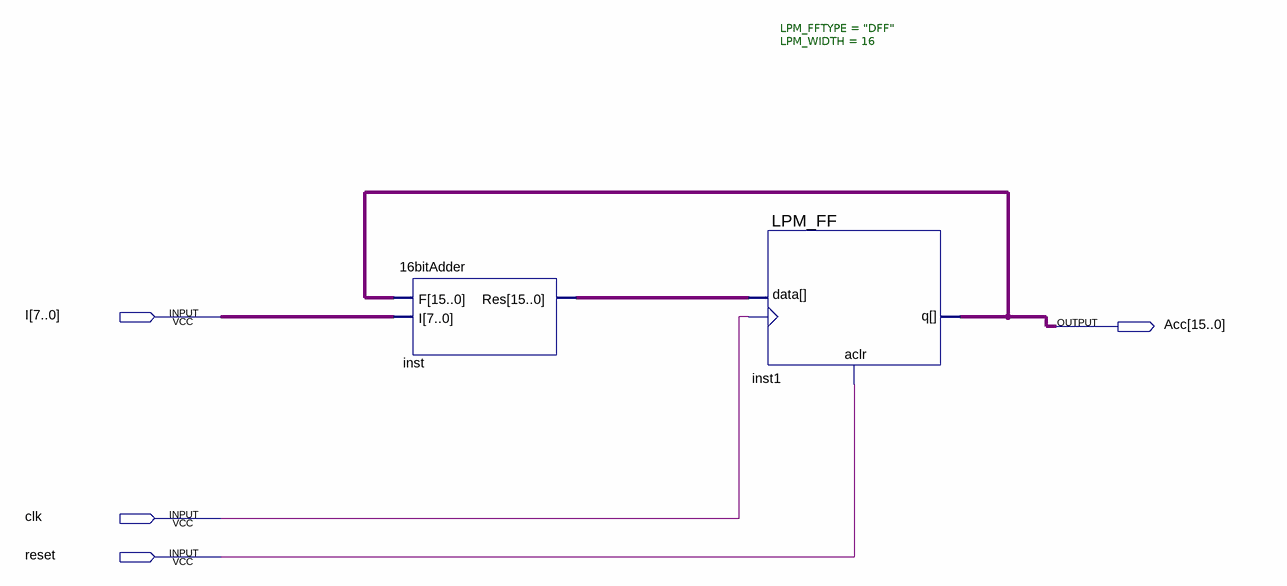
[diagram p0: schematic sheet]
// Quartus schematic Accumulator.bdf as structural Verilog: 2 symbols, 4 pins
module Accumulator (
  input  [7:0] I,
  input  clk,
  input  reset,
  output [15:0] Acc
);

  wire [15:0] inst_res;

  \16bitAdder  inst (.F(Acc), .I(I), .Res(inst_res));
  LPM_FF #(.LPM_FFTYPE("DFF"), .LPM_WIDTH(16)) inst1 (.aclr(reset), .clock(clk), .data(inst_res), .q(Acc));
endmodule
